# EAGLE schematic SchoolBot (EAGLE 9.1.0)

## Sheet 1 of 2
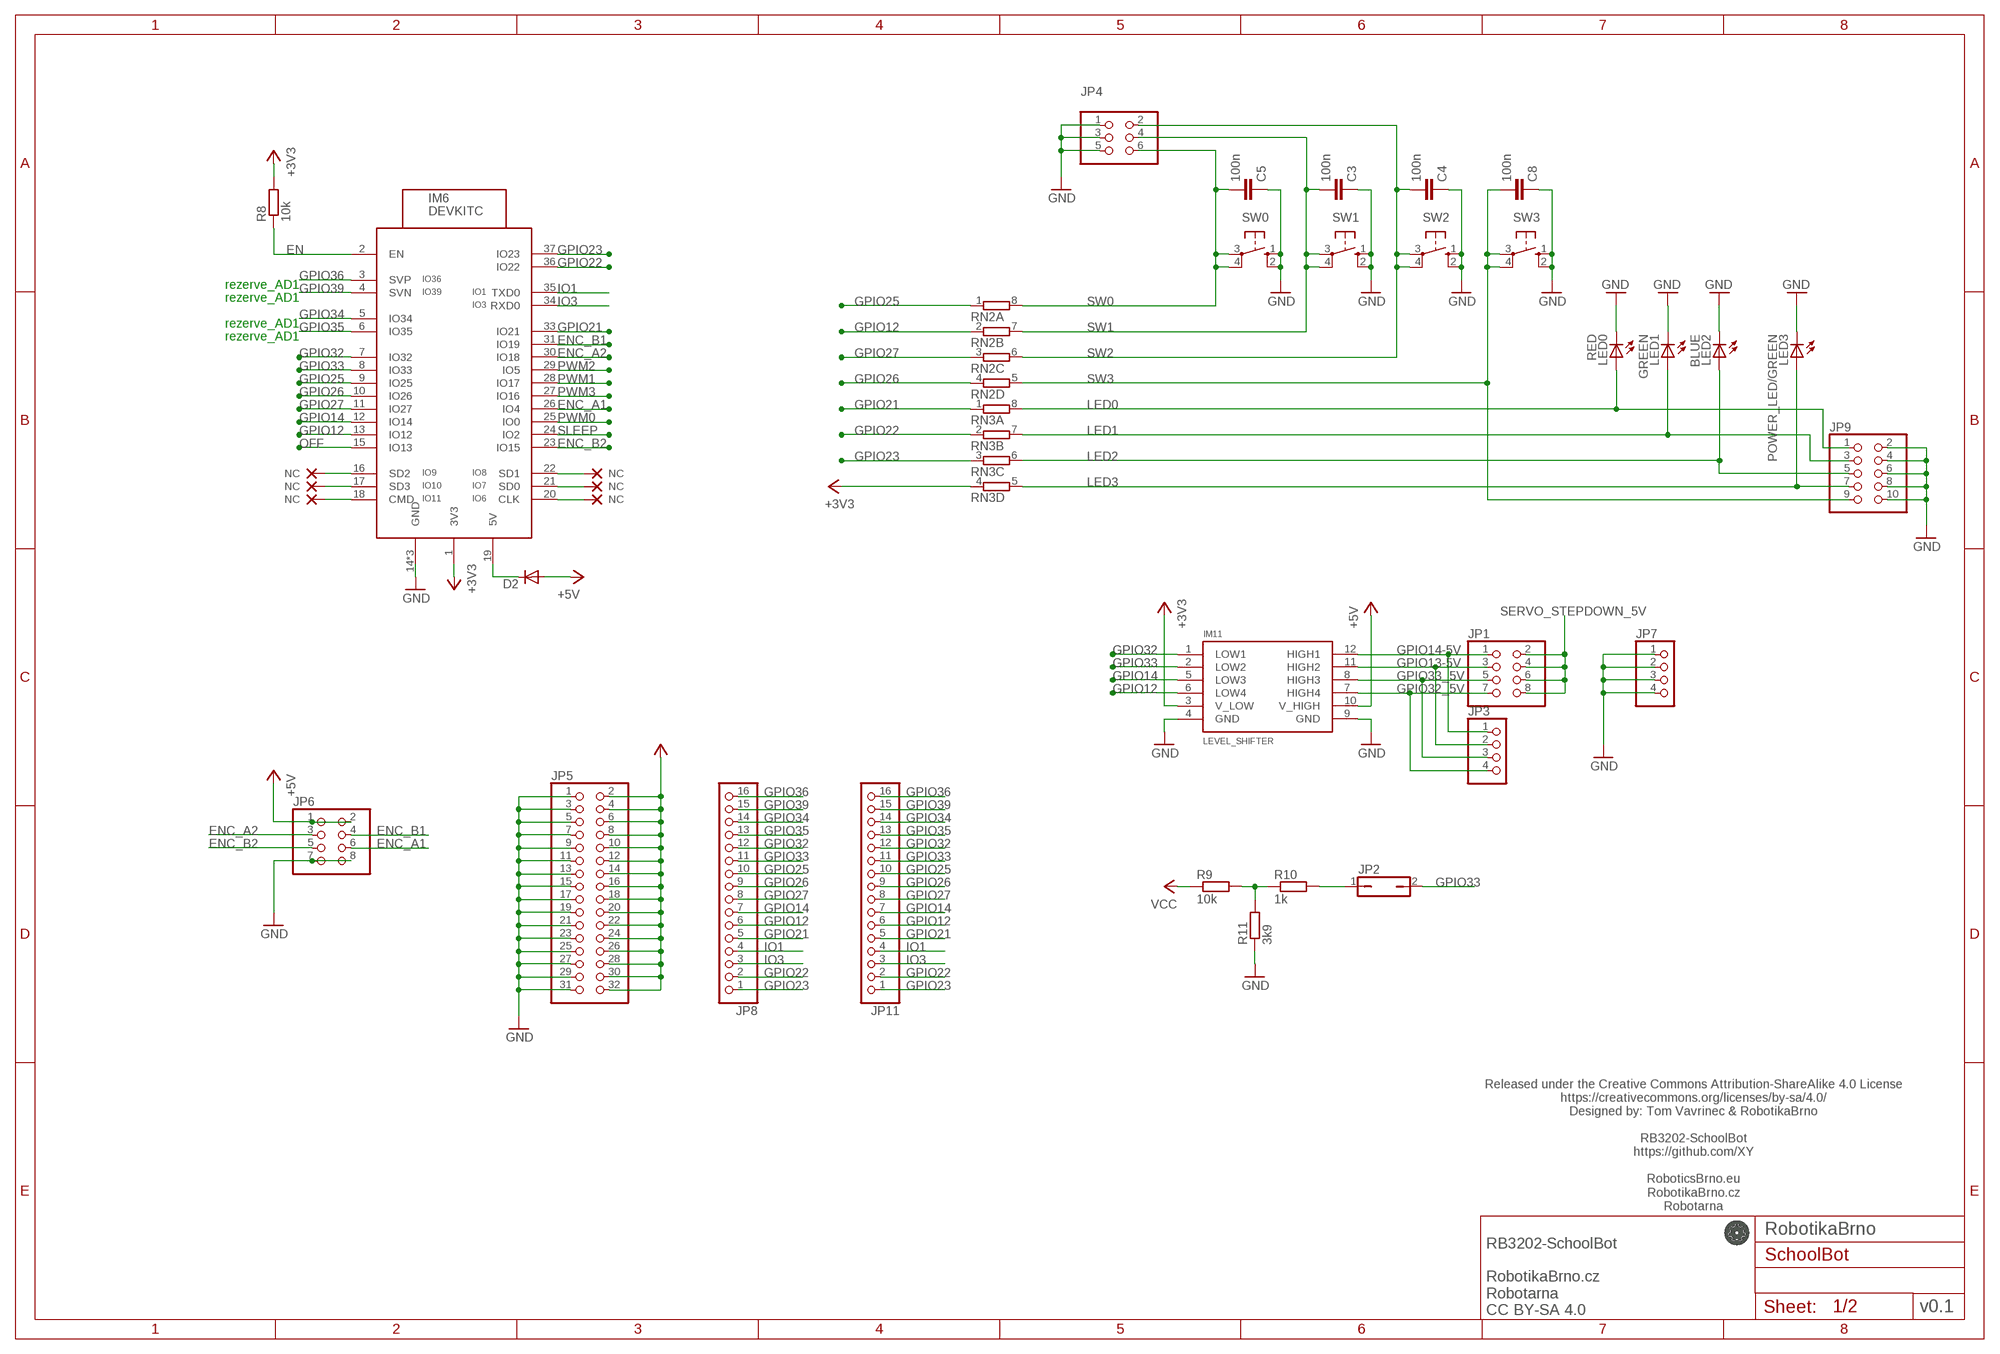
[diagram p0: schematic, sheet 1]

### Parts
C3  100n  C-EUC1206  [C1206]
C4  100n  C-EUC1206  [C1206]
C5  100n  C-EUC1206  [C1206]
C8  100n  C-EUC1206  [C1206]
D2  DIODE-D-7.5  [D-7.5]
IM6  DEVKITC  [DEVKITC]
IM11  LEVEL_SHIFTER  [LEVEL_SHIFTER]
JP1  PINHD-2X4  [2X04]
JP2  JP1Q  [JP1]
JP3  PINHD-1X4  [1X04]
JP4  PINHD-2X3  [2X03]
JP5  PINHD-2X16  [2X16]
JP6  PINHD-2X4  [2X04]
JP7  PINHD-1X4  [1X04]
JP8  PINHD-1X16  [1X16]
JP9  PINHD-2X5  [2X05]
JP11  PINHD-1X16  [1X16]
LED0  RED  LED3MM  [LED3MM]
LED1  GREEN  LED3MM  [LED3MM]
LED2  BLUE  LED3MM  [LED3MM]
LED3  POWER_LED/GREEN  LED3MM  [LED3MM]
NC1  NC  (no package)
NC2  NC  (no package)
NC3  NC  (no package)
NC4  NC  (no package)
NC5  NC  (no package)
NC6  NC  (no package)
R8  10k  R-EU_R0805  [R0805]
R9  10k  R-EU_M0805  [M0805]
R10  1k  R-EU_M0805  [M0805]
R11  3k9  R-EU_M0805  [M0805]
RN2  4R-NEXBS8V  [EXBS8V]
RN3  4R-NEXBS8V  [EXBS8V]
SW0  10-XX  [B3F-10XX]
SW1  10-XX  [B3F-10XX]
SW2  10-XX  [B3F-10XX]
SW3  10-XX  [B3F-10XX]

### Nets
+3V3: IM6.1(3V3) IM11.3(V_LOW) JP5.2 JP5.4 JP5.6 JP5.8 JP5.10 JP5.12 JP5.14 JP5.16 JP5.18 JP5.20 JP5.22 JP5.24 JP5.26 JP5.28 JP5.30 JP5.32 R8.2 RN3.4 ; also sheet 2
+5V: D2.A IM11.10(V_HIGH) JP6.1 JP6.2 ; also sheet 2
+5V_ESP: D2.C IM6.19(5V)
EN: IM6.2(EN) R8.1 ; also sheet 2
ENC_A1: IM6.26(IO4) JP6.6
ENC_A2: IM6.30(IO18) JP6.3
ENC_B1: IM6.31(IO19) JP6.4
ENC_B2: IM6.23(IO15) JP6.5
GND: C3.1 C4.1 C5.1 C8.1 IM6.14(GND) IM6.32(GND) IM6.38(GND) IM11.4(GND) IM11.9(GND) JP4.1 JP4.3 JP4.5 JP5.1 JP5.3 JP5.5 JP5.7 JP5.9 JP5.11 JP5.13 JP5.15 JP5.17 JP5.19 JP5.21 JP5.23 JP5.25 JP5.27 JP5.29 JP5.31 JP6.7 JP6.8 JP7.1 JP7.2 JP7.3 JP7.4 JP9.2 JP9.4 JP9.6 JP9.8 JP9.10 LED0.K(C) LED1.K(C) LED2.K(C) LED3.K(C) R11.1 SW0.1(S) SW0.2(S1) SW1.1(S) SW1.2(S1) SW2.1(S) SW2.2(S1) SW3.1(S) SW3.2(S1) ; also sheet 2
GPIO12: IM6.13(IO12) IM11.6(LOW4) JP8.6 JP11.6 RN2.2
GPIO13-5V: IM11.11(HIGH2) JP1.3 JP3.2
GPIO14: IM6.12(IO14) IM11.5(LOW3) JP8.7 JP11.7
GPIO14-5V: IM11.12(HIGH1) JP1.1 JP3.1
GPIO21: IM6.33(IO21) JP8.5 JP11.5 RN3.1
GPIO22: IM6.36(IO22) JP8.2 JP11.2 RN3.2
GPIO23: IM6.37(IO23) JP8.1 JP11.1 RN3.3 ; also sheet 2
GPIO25: IM6.9(IO25) JP8.10 JP11.10 RN2.1
GPIO26: IM6.10(IO26) JP8.9 JP11.9 RN2.4
GPIO27: IM6.11(IO27) JP8.8 JP11.8 RN2.3
GPIO32: IM6.7(IO32) IM11.1(LOW1) JP8.12 JP11.12
GPIO32_5V: IM11.7(HIGH4) JP1.7 JP3.4
GPIO33: IM6.8(IO33) IM11.2(LOW2) JP2.2 JP8.11 JP11.11
GPIO33_5V: IM11.8(HIGH3) JP1.5 JP3.3
GPIO34: IM6.5(IO34) JP8.14 JP11.14
GPIO35: IM6.6(IO35) JP8.13 JP11.13
GPIO36: IM6.3(SVP) JP8.16 JP11.16
GPIO39: IM6.4(SVN) JP8.15 JP11.15
IO1: IM6.35(TXD0) JP8.4 JP11.4
IO3: IM6.34(RXD0) JP8.3 JP11.3
IO9_NC: IM6.16(SD2) NC1.NC
IO9_NC1: IM6.20(CLK) NC4.NC
IO10_NC: IM6.17(SD3) NC2.NC
IO10_NC1: IM6.21(SD0) NC5.NC
IO11_NC: IM6.18(CMD) NC3.NC
IO11_NC1: IM6.22(SD1) NC6.NC
LED0: JP9.1 LED0.A RN3.8
LED1: JP9.3 LED1.A RN3.7
LED2: JP9.5 LED2.A RN3.6
LED3: JP9.7 LED3.A RN3.5
N$2: JP2.1 R10.2
N$4: R9.2 R10.1 R11.2
OFF: IM6.15(IO13) ; also sheet 2
PWM0: IM6.25(IO0) ; also sheet 2
PWM1: IM6.28(IO17) ; also sheet 2
PWM2: IM6.29(IO5) ; also sheet 2
PWM3: IM6.27(IO16) ; also sheet 2
SERVO_STEPDOWN_5V: JP1.2 JP1.4 JP1.6 JP1.8 ; also sheet 2
SLEEP: IM6.24(IO2) ; also sheet 2
SW0: C5.2 JP4.6 RN2.8 SW0.3(P) SW0.4(P1)
SW1: C3.2 JP4.4 RN2.7 SW1.3(P) SW1.4(P1)
SW2: C4.2 JP4.2 RN2.6 SW2.3(P) SW2.4(P1)
SW3: C8.2 JP9.9 RN2.5 SW3.3(P) SW3.4(P1)
VCC: R9.1 ; also sheet 2

### Notes on the sheet
- rezerve_AD1
- rezerve_AD1
- rezerve_AD1
- rezerve_AD1
- Released under the Creative Commons Attribution-ShareAlike 4.0 License
  https://creativecommons.org/licenses/by-sa/4.0/
  Designed by: Tom Vavrinec & RobotikaBrno
  
  RB3202-SchoolBot
  https://github.com/XY
  
  RoboticsBrno.eu
  RobotikaBrno.cz
  Robotarna
- RobotikaBrno
- v0.1
- RB3202-SchoolBot
  
  RobotikaBrno.cz
  Robotarna
  CC BY-SA 4.0

## Sheet 2 of 2
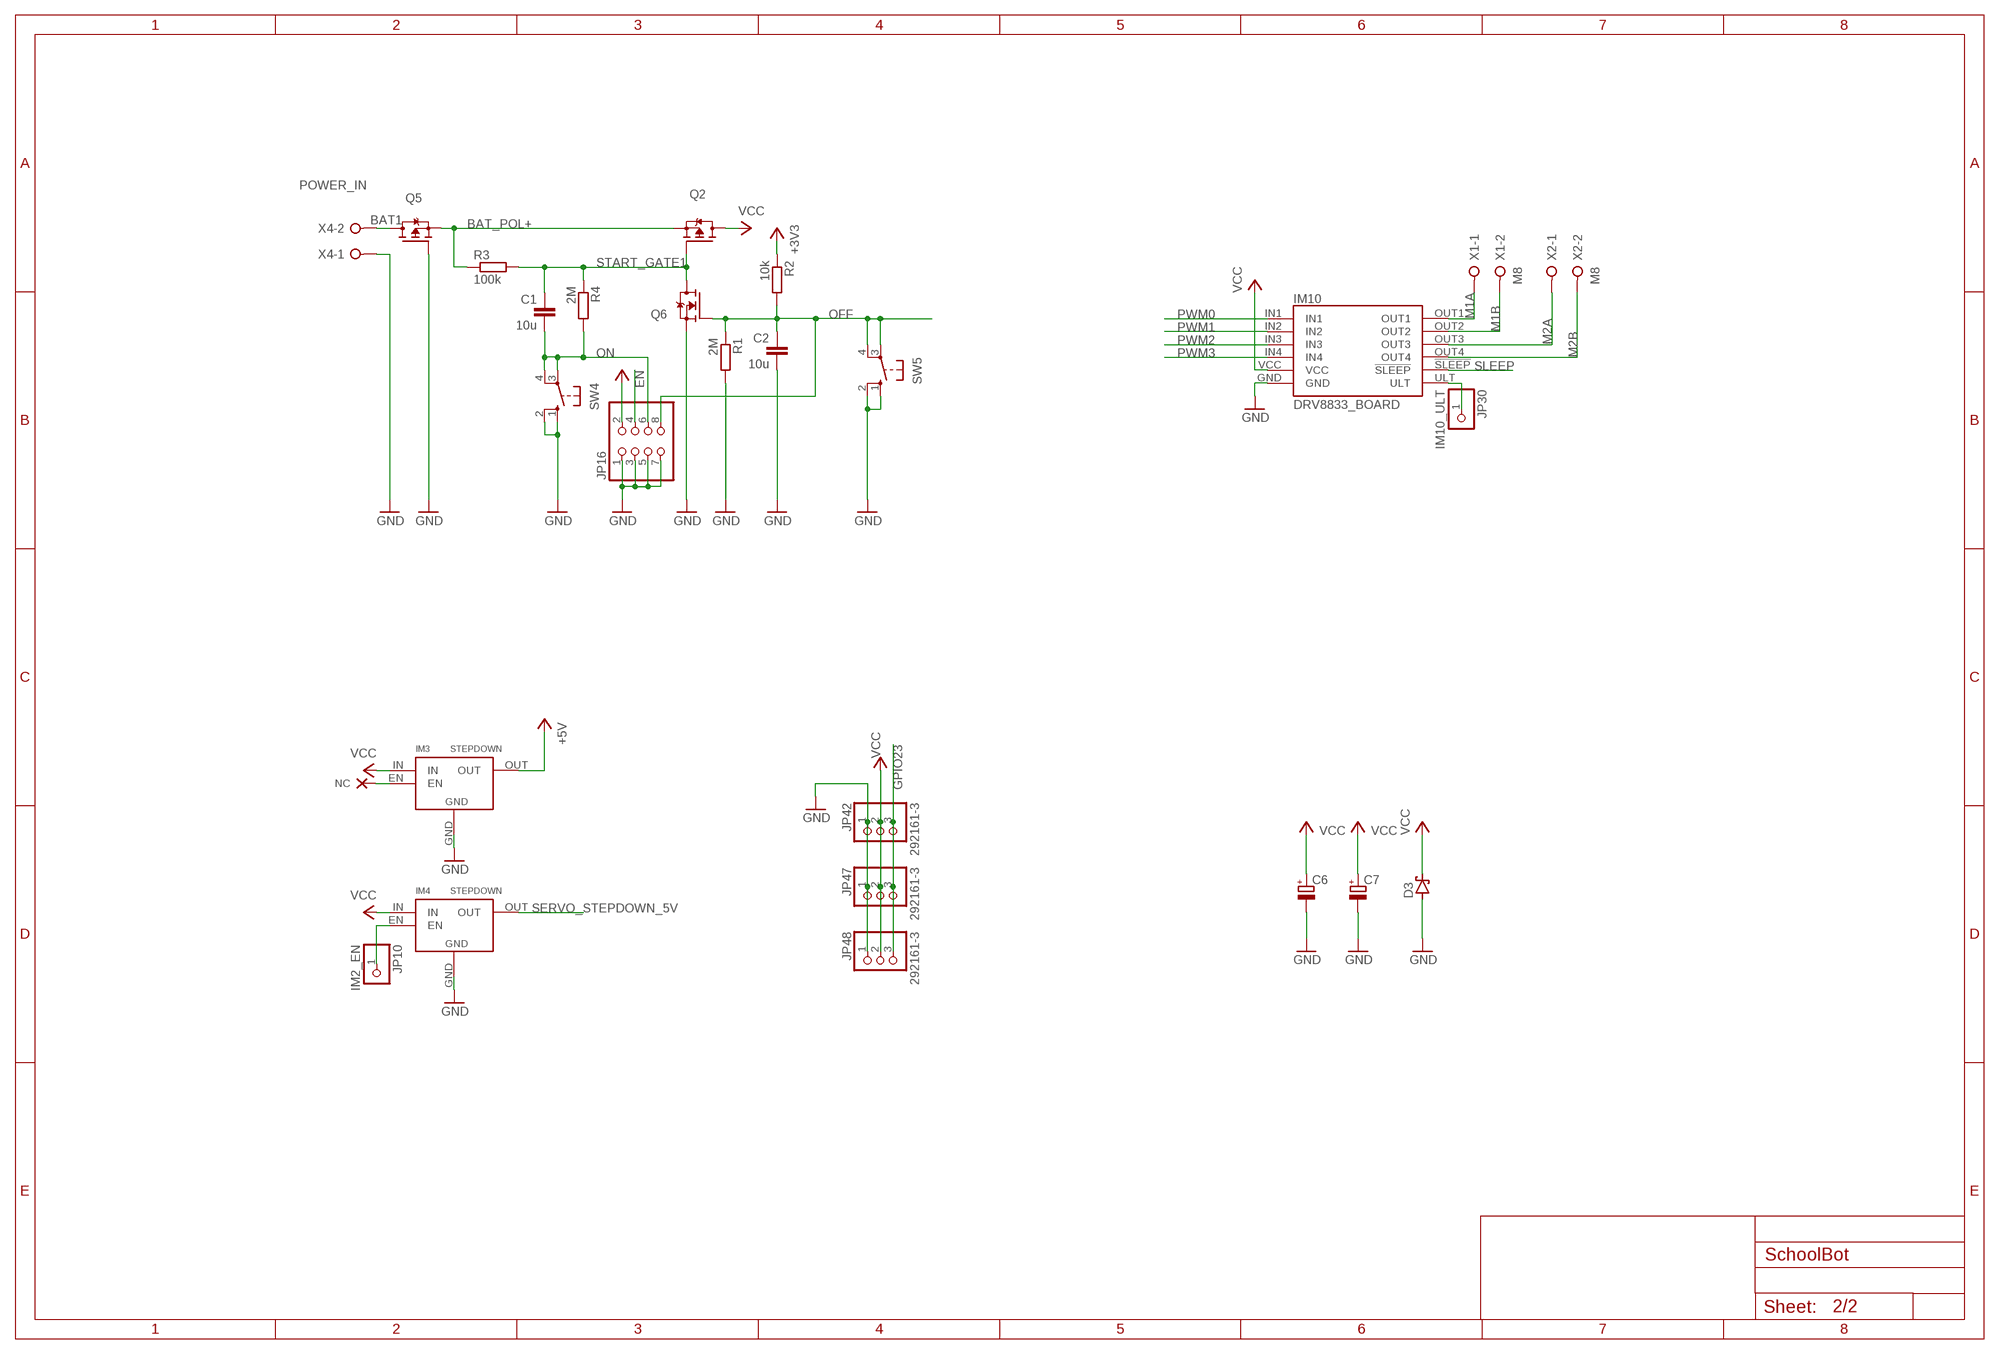
[diagram p1: schematic, sheet 2]

### Parts
C1  10u  C-EUC1206  [C1206]
C2  10u  C-EUC1206  [C1206]
C6  CPOL-EUE5-10.5  [E5-10,5]
C7  CPOL-EUE5-10.5  [E5-10,5]
D3  SCHOTTKY-DIODEF126Z12  [F126Z12]
IM3  STEPDOWN  [STEPDOWN]
IM4  STEPDOWN  [STEPDOWN]
IM10  DRV8833_BOARD  [PINHEAD]
JP10  IM2_EN  PINHD-1X1  [1X01]
JP16  PINHD-2X4  [2X04]
JP30  IM10_ULT  PINHD-1X1  [1X01]
JP42  292161-3  [292161-3]
JP47  292161-3  [292161-3]
JP48  292161-3  [292161-3]
NC7  NC  (no package)
Q2  P-MOSFET-TO220V  [TO220V]
Q5  P-MOSFET-TO220V  [TO220V]
Q6  N-MOSFET-SOT23-GSD  [SOT23]
R1  2M  R-EU_R0805  [R0805]
R2  10k  R-EU_R0805  [R0805]
R3  100k  R-EU_R0805  [R0805]
R4  2M  R-EU_M0805  [M0805]
SW4  10-XX  [B3F-10XX]
SW5  10-XX  [B3F-10XX]
X1  M8  W237-02P  [W237-132]
X2  M8  W237-02P  [W237-132]
X4  POWER_IN  W237-02P  [W237-132]

### Nets
+3V3: R2.1 ; also sheet 1
+5V: IM3.OUT JP16.2 ; also sheet 1
BAT1: Q5.2(D) X4.2
BAT_POL+: Q2.3(S) Q5.3(S) R3.1
EN: JP16.4 ; also sheet 1
GND: C2.2 C6.- C7.- D3.A IM3.GND IM4.GND IM10.GND JP16.1 JP16.3 JP16.5 JP16.7 JP42.1 JP47.1 JP48.1 Q5.1(G) Q6.2(S) R1.2 SW4.1(S) SW4.2(S1) SW5.1(S) SW5.2(S1) X4.1 ; also sheet 1
GPIO23: JP42.3 JP47.3 JP48.3 ; also sheet 1
IO9_NC2: IM3.EN NC7.NC
M1A: IM10.OUT1 X1.1
M1B: IM10.OUT2 X1.2
M2A: IM10.OUT3 X2.1
M2B: IM10.OUT4 X2.2
N$1: IM10.ULT JP30.1
OFF: C2.1 JP16.8 Q6.1(G) R1.1 R2.2 SW5.3(P) SW5.4(P1) ; also sheet 1
ON: C1.2 JP16.6 R4.2 SW4.3(P) SW4.4(P1)
PWM0: IM10.IN1 ; also sheet 1
PWM1: IM10.IN2 ; also sheet 1
PWM2: IM10.IN3 ; also sheet 1
PWM3: IM10.IN4 ; also sheet 1
SERVO_STEPDOWN_5V: IM4.OUT ; also sheet 1
SLEEP: IM10.!SLEEP ; also sheet 1
START_GATE1: C1.1 Q2.1(G) Q6.3(D) R3.2 R4.1
STEP2_EN1: IM4.EN JP10.1
VCC: C6.+ C7.+ D3.C IM3.IN IM4.IN IM10.VCC JP42.2 JP47.2 JP48.2 Q2.2(D) ; also sheet 1

## Library data of the parts
C1-C5 C8 = rcl_upravena:C-EU: CAPACITOR, European symbol
C6 C7 = rcl:CPOL-EU: POLARIZED CAPACITOR, European symbol; SPICEPREFIX: C
D2 = diode:DIODE-: DIODE
D3 = diode:SCHOTTKY-DIODE: Schottky Diode
IM3 IM4 = StepDown:STEPDOWN
IM6 = esp32:DEVKITC
IM10 = DRV8833board:DRV8833_BOARD
IM11 = LevelShifter:LEVEL_SHIFTER
JP1 JP6 JP16 = pinhead:PINHD-2X4: PIN HEADER
JP2 = jumper:JP1Q: JUMPER
JP3 JP7 = pinhead:PINHD-1X4: PIN HEADER
JP4 = pinhead:PINHD-2X3: PIN HEADER
JP5 = pinhead:PINHD-2X16: PIN HEADER
JP8 JP11 = pinhead:PINHD-1X16: PIN HEADER
JP9 = pinhead:PINHD-2X5: PIN HEADER
JP10 JP30 = pinhead:PINHD-1X1: PIN HEADER
JP42 JP47 JP48 = iServo_connector:292161-3
LED0 LED1-LED3 = led:LED: LED OSRAM: - CHIPLED LG R971, LG N971, LY N971, LG Q971, LY Q971, LO R971, LY R971 LH N974, LH R974 LS Q976, LO Q976, LY Q976 LO Q996 - Hyper CHIPLED LW Q18S LB Q993, LB Q99A, LB R99A - SideLED LS A670, LO A670, LY A670, LG A670, LP A670 LB A673, LV A673, LT A673, LW A673 LH A674 LY A675 LS A676, LA A676, LO A676, LY A676, LW A676 LS A679, LY A679, LG A679 - Hyper Micro SIDELED® LS Y876, LA Y876, LO Y876, LY Y876 LT Y87S - SmartLED LW L88C, LW L88S LB L89C, LB L89S, LG L890 LS L89K, LO L89K, LY L89K LS L896, LA L896, LO L896, LY L896 - TOPLED LS T670, LO T670, LY T670, LG T670, LP T670 LSG T670, LSP T670, LSY T670, LOP T670, LYG T670 LG T671, LOG T671, LSG T671 LB T673, LV T673, LT T673, LW T673 LH T674 LS T676, LA T676, LO T676, LY T676, LB T676, LH T676, LSB T676, LW T676 LB T67C, LV T67C, LT T67C, LS T67K, LO T67K, LY T67K, LW E67C LS E67B, LA E67B, LO E67B, LY E67B, LB E67C, LV E67C, LT E67C LW T67C LS T679, LY T679, LG T679 LS T770, LO T770, LY T770, LG T770, LP T770 LB T773, LV T773, LT T773, LW T773 LH T774 LS E675, LA E675, LY E675, LS T675 LS T776, LA T776, LO T776, LY T776, LB T776 LHGB T686 LT T68C, LB T68C - Hyper Mini TOPLED® LB M676 - Mini TOPLED Santana® LG M470 LS M47K, LO M47K, LY M47K Source: http://www.osram.convergy.de LUXEON: - LUMILED® LXK2-PW12-R00, LXK2-PW12-S00, LXK2-PW14-U00, LXK2-PW14-V00 LXK2-PM12-R00, LXK2-PM12-S00, LXK2-PM14-U00 LXK2-PE12-Q00, LXK2-PE12-R00, LXK2-PE12-S00, LXK2-PE14-T00, LXK2-PE14-U00 LXK2-PB12-K00, LXK2-PB12-L00, LXK2-PB12-M00, LXK2-PB14-N00, LXK2-PB14-P00, LXK2-PB14-Q00 LXK2-PR12-L00, LXK2-PR12-M00, LXK2-PR14-Q00, LXK2-PR14-R00 LXK2-PD12-Q00, LXK2-PD12-R00, LXK2-PD12-S00 LXK2-PH12-R00, LXK2-PH12-S00 LXK2-PL12-P00, LXK2-PL12-Q00, LXK2-PL12-R00 Source: www.luxeon.com KINGBRIGHT: KA-3528ASYC Source: www.kingbright.com
NC1-NC7 = NC:NC: _EXTERNAL_
Q2 Q5 = transistors:P-MOSFET
Q6 = transistors:N-MOSFET
R1-R4 R8 = rcl_upravena:R-EU_: RESISTOR, European symbol
R9-R11 = resistor:R-EU_: RESISTOR, European symbol
RN2 RN3 = resistor-dil:4R-N: Array Chip Resistor Source: RS Component / Phycomp; OC_FARNELL: unknown; OC_NEWARK: unknown
SW0 SW1-SW5 = switch-omron:10-XX: OMRON SWITCH; MPN: B3F-1000; OC_FARNELL: 176432; OC_NEWARK: 36M3542
X1 X2 X4 = con-wago-508:W237-02P: WAGO SREW CLAMP; OC_FARNELL: unknown; OC_NEWARK: unknown

## Net classes
0 default: width 0.2 mm, drill 0.35 mm, clearance 0.2 mm